# EAGLE schematic load_switch_breakout (EAGLE 6.5.0)
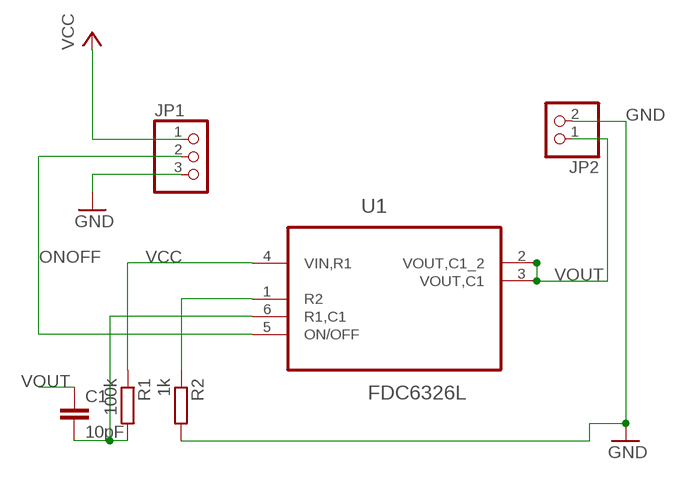
[diagram p0: schematic, sheet 1]

## Parts
C1  10pF  C-EUC0805K  [C0805K]
JP1  PINHD-1X3  [1X03]
JP2  PINHD-1X2  [1X02]
R1  100k  R-EU_M0805  [M0805]
R2  1k  R-EU_M0805  [M0805]
U1  FDC6326L  [SOT95P280X110-6N]

## Nets
GND: JP1.3 JP2.2 R2.2
N$3: C1.2 R1.2 U1.6(R1,C1)
N$4: R2.1 U1.1(R2)
ONOFF: JP1.2 U1.5(ON/OFF)
VCC: JP1.1 R1.1 U1.4(VIN,R1)
VOUT: C1.1 JP2.1 U1.2(VOUT,C1_2) U1.3(VOUT,C1)

## Library data of the parts
C1 = rcl:C-EU: CAPACITOR, European symbol
JP1 = pinhead:PINHD-1X3: PIN HEADER
JP2 = pinhead:PINHD-1X2: PIN HEADER
R1 R2 = rcl:R-EU_: RESISTOR, European symbol
U1 = Fairchild_By_element14_Batch_1:FDC6326L: Integrated Load Switch; MPN: FDC6326L; OC_FARNELL: 1706325; OC_NEWARK: 58K1423; PACKAGE: SSOT-23-6; SUPPLIER: FAIRCHILD SEMICONDUCTOR